# Altium project MantraDisplay.PrjPcb
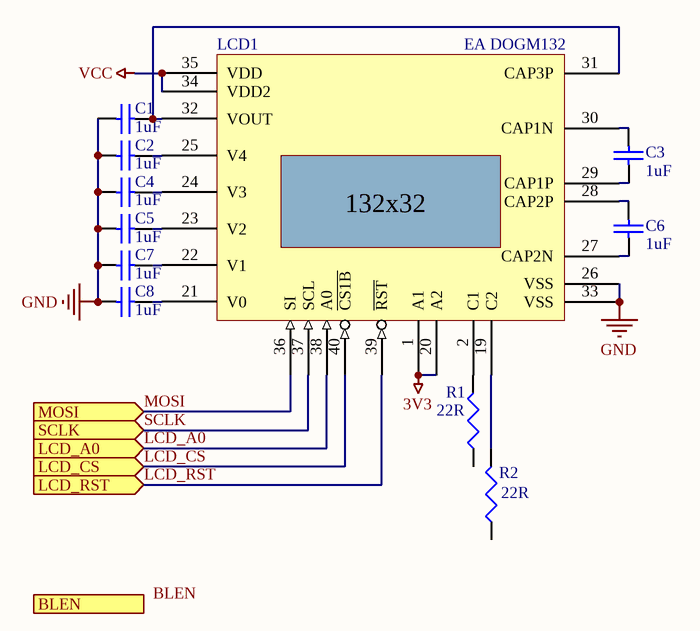
[diagram p0: Sheet1.SchDoc]
1 sheet, 11 parts. Net scope: flat (ports and power ports of the same name join across sheets).
Board file: PCB1.PcbDoc

## Sheet Sheet1.SchDoc
size A4

### Parts
C1  value 1uF  [1608[0603]]  (hidden comment: Cap Semi)
C2  value 1uF  [1608[0603]]  (hidden comment: Cap Semi)
C3  value 1uF  [1608[0603]]  (hidden comment: Cap Semi)
C4  value 1uF  [1608[0603]]  (hidden comment: Cap Semi)
C5  value 1uF  [1608[0603]]  (hidden comment: Cap Semi)
C6  value 1uF  [1608[0603]]  (hidden comment: Cap Semi)
C7  value 1uF  [1608[0603]]  (hidden comment: Cap Semi)
C8  value 1uF  [1608[0603]]  (hidden comment: Cap Semi)
LCD1  EA DOGM132  [EA DOGM132-5]
R1  value 22R  [J1-0603]  (hidden comment: Res3)
R2  value 22R  [J1-0603]  (hidden comment: Res3)

### Ports
BLEN (in), LCD_A0 (in), LCD_CS (in), LCD_RST (in), MOSI (in), SCLK (in)

### Nets
3V3: LCD1.1(A1) LCD1.20(A2)
GND: C1.1 C2.1 C4.1 C5.1 C7.1 C8.1 LCD1.26(VSS) LCD1.33(VSS)
VCC: LCD1.34(VDD2) LCD1.35(VDD)
LCD_A0: LCD1.38(A0) ; port LCD_A0
LCD_CS: LCD1.40(~{CS1B}) ; port LCD_CS
LCD_RST: LCD1.39(~{RST}) ; port LCD_RST
MOSI: LCD1.36(SI) ; port MOSI
SCLK: LCD1.37(SCL) ; port SCLK
NetC1_2: C1.2 LCD1.31(CAP3P) LCD1.32(VOUT)
NetC2_2: C2.2 LCD1.25(V4)
NetC3_1: C3.1 LCD1.30(CAP1N)
NetC3_2: C3.2 LCD1.29(CAP1P)
NetC4_2: C4.2 LCD1.24(V3)
NetC5_2: C5.2 LCD1.23(V2)
NetC6_1: C6.1 LCD1.28(CAP2P)
NetC6_2: C6.2 LCD1.27(CAP2N)
NetC7_2: C7.2 LCD1.22(V1)
NetC8_2: C8.2 LCD1.21(V0)
NetLCD1_2: LCD1.2(C1) R1.2
NetLCD1_19: LCD1.19(C2) R2.2

Not connected (* = marked no-connect by the designer): R1 1; R2 1

### Notes on the sheet
- Labels drawn without touching a wire or pin: BLEN
- (in symbol EA DOGM132) 132x32

### Library data of the parts
C1-C8 = Cap Semi: Capacitor (Semiconductor SIM Model); Published: 8-Jun-2000; LatestRevisionDate: 29-May-2009; LatestRevisionNote: IPC-7351 Footprint Added.; PackageReference: C1206; Publisher: Altium Limited; PackageDescription: Chip Capacitor
LCD1 = EA DOGM132: 132x32 graphical LCD
R1 R2 = Res3: Resistor; Published: 8-Jun-2000; LatestRevisionDate: 29-May-2009; LatestRevisionNote: IPC-7351 Footprint Added.; PackageReference: J1-0603; Publisher: Altium Limited; PackageDescription: Chip Resistor